# EAGLE design Display (EAGLE 4.14)
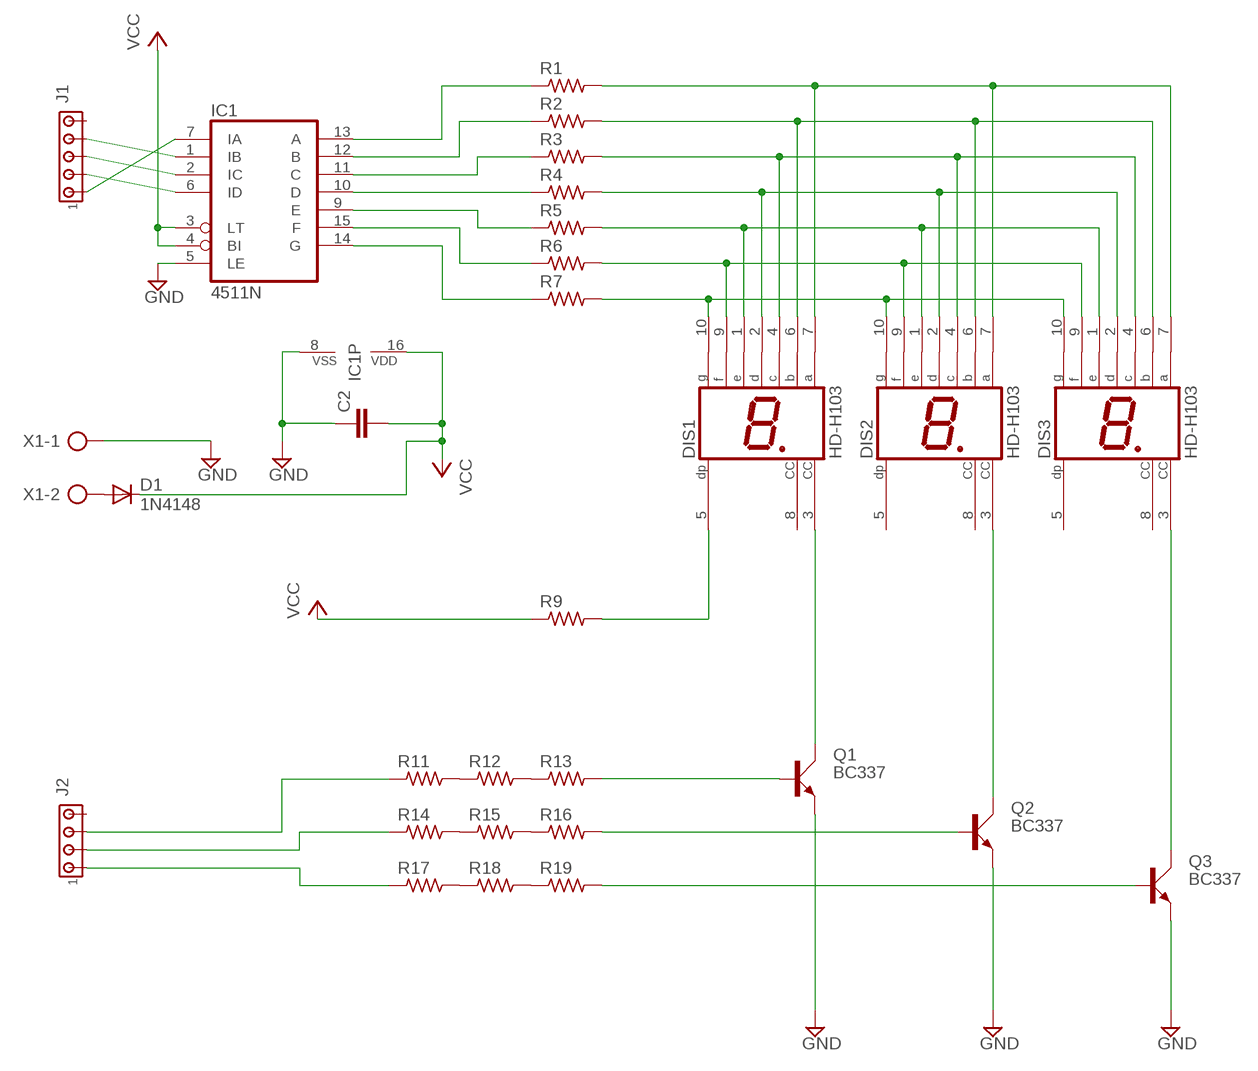
[diagram p0: schematic, sheet 1]

## Parts
C2  C5/3  [C5B3]
D1  1N4148  [DO35-10]
DIS1  HD-H103  [HDSP-M]
DIS2  HD-H103  [HDSP-M]
DIS3  HD-H103  [HDSP-M]
IC1  4511N  [DIL16]
J1  MTA05-100  [10X05MTA]
J2  MTA04-100  [10X04MTA]
Q1  BC337  [SOT54A]
Q2  BC337  [SOT54A]
Q3  BC337  [SOT54A]
R1  R_0603  [R0603]
R2  R_0603  [R0603]
R3  R_0603  [R0603]
R4  R_0603  [R0603]
R5  R_0603  [R0603]
R6  R_0603  [R0603]
R7  R_0603  [R0603]
R9  R_0603  [R0603]
R11  R_0603  [R0603]
R12  R_0603  [R0603]
R13  R_0603  [R0603]
R14  R_0603  [R0603]
R15  R_0603  [R0603]
R16  R_0603  [R0603]
R17  R_0603  [R0603]
R18  R_0603  [R0603]
R19  R_0603  [R0603]
X1  AK500/2  [AK500/2]

## Nets
GND: C2.1 IC1.5(LE) IC1.8(VSS) Q1.E Q2.E Q3.E X1.1
N$1: DIS1.10(G) DIS2.10(G) DIS3.10(G) R7.2
N$2: DIS1.9(F) DIS2.9(F) DIS3.9(F) R6.2
N$3: DIS1.1(E) DIS2.1(E) DIS3.1(E) R5.2
N$4: DIS1.2(D) DIS2.2(D) DIS3.2(D) R4.2
N$5: DIS1.4(C) DIS2.4(C) DIS3.4(C) R3.2
N$6: DIS1.6(B) DIS2.6(B) DIS3.6(B) R2.2
N$7: DIS1.7(A) DIS2.7(A) DIS3.7(A) R1.2
N$8: IC1.13(A) R1.1
N$9: IC1.14(G) R7.1
N$10: IC1.15(F) R6.1
N$11: IC1.12(B) R2.1
N$12: IC1.11(C) R3.1
N$13: IC1.9(E) R5.1
N$14: IC1.10(D) R4.1
N$16: DIS1.5(DP) R9.2
N$18: R11.2 R12.1
N$19: DIS1.3(CC) Q1.C
N$20: DIS2.3(CC) Q2.C
N$21: DIS3.3(CC) Q3.C
N$22: R12.2 R13.1
N$23: Q1.B R13.2
N$24: Q2.B R16.2
N$25: Q3.B R19.2
N$26: R14.2 R15.1
N$27: R15.2 R16.1
N$31: J2.3 R11.1
N$32: J2.2 R14.1
N$33: R17.2 R18.1
N$34: J2.1 R17.1
N$35: IC1.1(IB) J1.4
N$36: IC1.2(IC) J1.3
N$37: IC1.6(ID) J1.2
N$38: IC1.7(IA) J1.1
N$39: D1.A X1.2
N$40: R18.2 R19.1
VCC: C2.2 D1.C IC1.3(LT) IC1.4(BI) IC1.16(VDD) R9.1
Unconnected: DIS1.8(CC) DIS2.5(DP) DIS2.8(CC) DIS3.5(DP) DIS3.8(CC) J1.5 J2.4

## Library data of the parts
C2 = capacitor-wima:C: CAPACITOR naming: grid - package width
D1 = diode:1N4148: DIODE high speed (Philips)
DIS1-DIS3 = display-hp:HD-H103: LED DISPLAY 1-character 7 segment, decimal point right
IC1 = 45xx:4511: BCD to 7-segment LATCH/DECODER/DRIVER
J1 = con-amp:MTA05-100: AMP connector
J2 = con-amp:MTA04-100: AMP connector
Q1-Q3 = transistor-small-signal:BC337: NPN TRANSISTOR
R1-R7 R9 R11-R19 = rc-master:R_: RESISTOR
X1 = con-ptr500:AK500/2: CONNECTOR

## Board
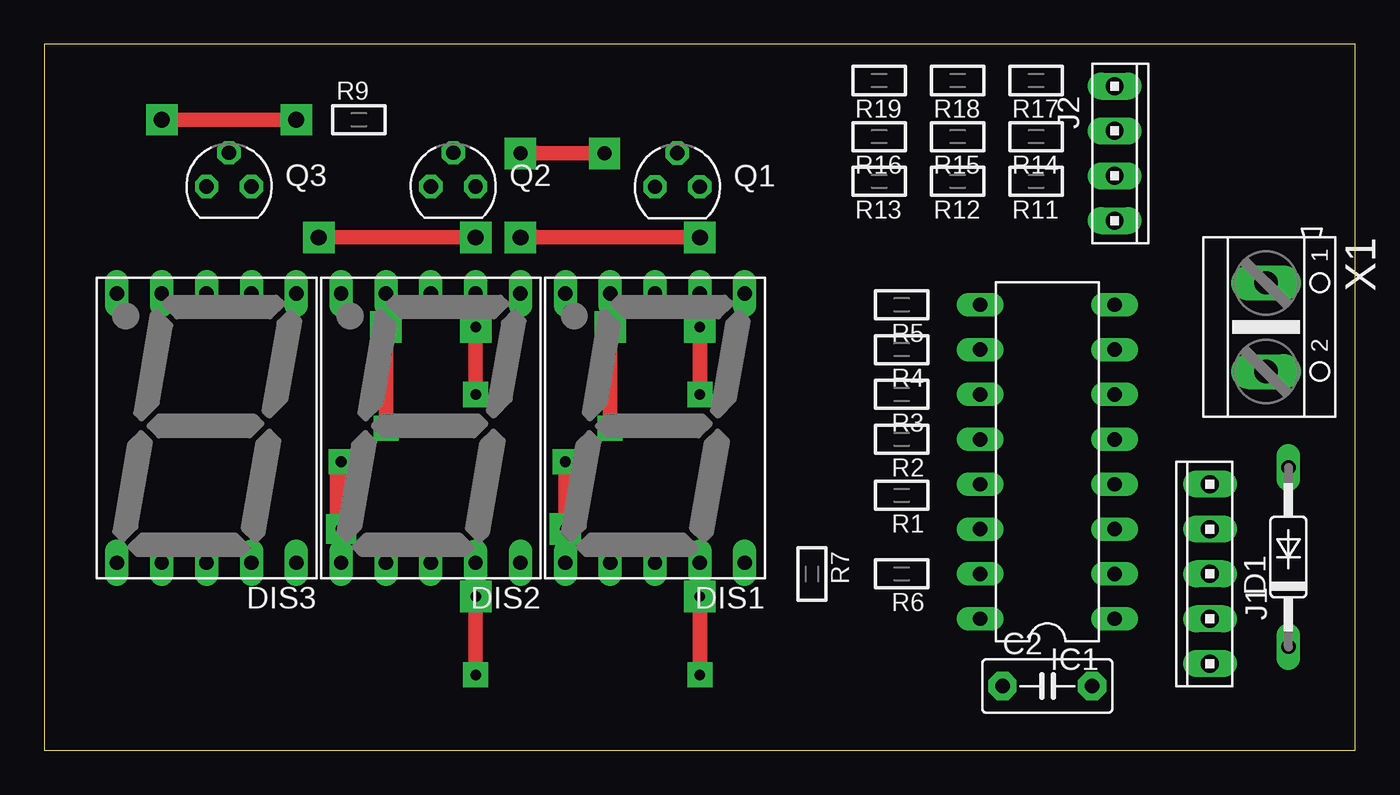
[diagram p1: board, top side]
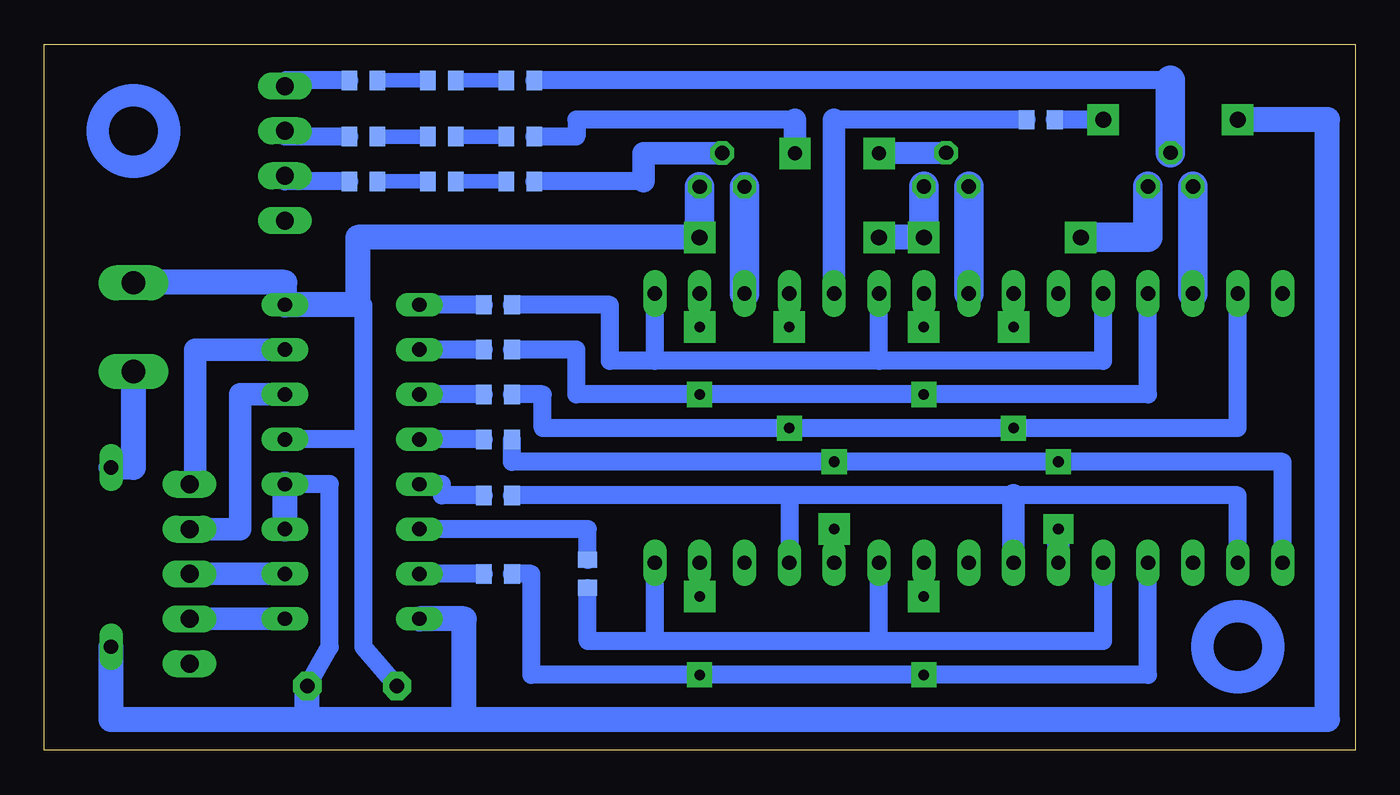
[diagram p2: board, bottom side, seen from below]

Size 74.28 x 39.99 mm. Coordinates in mm from the lower left corner, seen from the top.
Outline: 0,0 74.27,0 74.27,39.99 0,39.99 0,0
Copper layers (1*16): Top 0.035mm / dielectric 1.5mm / Bottom 0.035mm
Design rules "default": minimum track width 10mil, minimum drill 24mil, track to track 8mil, track to pad 8mil, pad to pad 8mil, via to via 8mil, smd to smd 8mil, copper to edge 40mil, drill to drill 8mil, minimum pad ring 10mil, minimum via ring 8mil, stop-mask expansion 4mil, vias tented up to drill 0mil, thermal gap 10mil

### Footprints (pad centres in the part's own frame; a part is rotated, then mirrored left to right if it is on the bottom)
C5B3 = drill 0.813 pad 1.6 octagon: 1 -2.54,0; 2 2.54,0
DO35-10 = drill 0.813 long: A 5.08,0; C -5.08,0
HDSP-M = drill 0.813 long: 1 -5.08,-7.62; 2 -2.54,-7.62; 3 0,-7.62; 4 2.54,-7.62; 5 5.08,-7.62; 6 5.08,7.62; 7 2.54,7.62; 8 0,7.62; 9 -2.54,7.62; 10 -5.08,7.62
DIL16 = drill 0.813 long: 1 -8.89,-3.81; 2 -6.35,-3.81; 3 -3.81,-3.81; 4 -1.27,-3.81; 5 1.27,-3.81; 6 3.81,-3.81; 7 6.35,-3.81; 8 8.89,-3.81; 9 8.89,3.81; 10 6.35,3.81; 11 3.81,3.81; 12 1.27,3.81; 13 -1.27,3.81; 14 -3.81,3.81; 15 -6.35,3.81; 16 -8.89,3.81
10X05MTA = drill 1.016 long: 1 5.08,0; 2 2.54,0; 3 0,0; 4 -2.54,0; 5 -5.08,0
10X04MTA = drill 1.016 long: 1 -3.81,0; 2 -1.27,0; 3 1.27,0; 4 3.81,0
SOT54A = drill 0.813 octagon: B 0,1.905; C -1.27,0; E 1.27,0
R0603 = smd 0.9 x 1.1 bottom: 1 -0.794,0; 2 0.794,0
AK500/2 = drill 1.321 long: 1 -2.515,0; 2 2.515,0

### Placement (x,y rotation side)
C2  56.83,3.65 0 top
D1  70.48,10.95 90 top
DIS1  34.6,18.25 180 top
DIS2  21.9,18.25 180 top
DIS3  9.2,18.25 180 top
IC1  56.83,16.35 90 top
J1  66.04,10 90 top
J2  60.64,33.81 270 top
Q1  35.87,31.92 0 top
Q2  23.17,31.94 0 top
Q3  10.47,31.94 0 top
R1  48.57,14.44 180 top
R2  48.57,17.62 180 top
R3  48.57,20.16 180 top
R4  48.57,22.7 180 top
R5  48.57,25.23 180 top
R6  48.57,10 180 top
R7  43.49,10 270 top
R9  17.83,35.71 0 top
R11  56.19,32.22 180 top
R12  51.75,32.22 180 top
R13  47.3,32.22 180 top
R14  56.19,34.76 180 top
R15  51.75,34.76 180 top
R16  47.3,34.76 180 top
R17  56.19,37.93 180 top
R18  51.75,37.93 180 top
R19  47.3,37.93 180 top
X1  69.21,23.96 270 top

### Tracks (layer width: path | path; a pad name or v marks a point on that pad's centre or on a via)
GND  (via drill 0.9 pad 1.78)
  Top 0.813: v15.55,29.04 v24.44,29.04 | v26.98,29.04 v37.14,29.04
  Bottom 1.016: 56.19,17.62 56.19,25.23 56.51,25.23 | 56.19,17.62 IC1.5 | 56.19,17.62 56.19,5.87 C2.1
  Bottom 1.422: v24.44,29.04 v26.98,29.04 | v37.14,29.04 56.51,29.04 56.51,25.23 IC1.8 60.64,26.5 69.21,26.5 X1.1 68.57,26.5
  Bottom 1.676: v24.44,29.04 Q2.E | v37.14,29.04 Q1.E | v15.55,29.04 11.74,29.04 Q3.E
N$1
  Bottom 0.813: DIS2.10 26.98,8.09
  Bottom 1.016: 26.98,6.18 14.28,6.18 DIS3.10 | 26.98,6.18 39.68,6.18 | 39.68,6.18 DIS1.10 | 26.98,6.18 DIS2.10 | 39.68,6.18 43.49,6.18 R7.2
N$2  (via drill 0.6 pad 1.42, 0.6 pad 1.78)
  Top 0.813: v37.14,8.73 v37.14,4.28 DIS1.9 | v24.44,4.28 v24.44,8.73
  Bottom 0.813: v24.44,8.73 DIS2.9 | v37.14,8.73 DIS1.9 v37.14,8.73
  Bottom 1.016: R6.2 46.67,10 46.67,4.28 v37.14,4.28 v24.44,4.28 11.74,4.28 DIS3.9
N$3
  Bottom 1.016: 26.98,22.06 14.28,22.06 DIS3.1 | 26.98,22.06 39.68,22.06 | 39.68,22.06 DIS1.1 | 26.98,22.06 DIS2.1 | 39.68,22.06 42.22,22.06 42.22,25.23 R5.2
N$4  (via drill 0.6 pad 1.42, 0.6 pad 1.78)
  Top 0.813: v37.14,20.16 v37.14,23.96 | v24.44,20.16 v24.44,23.96
  Bottom 0.813: v37.14,23.96 DIS1.2 | v24.44,23.96 DIS2.2
  Bottom 1.016: R4.2 44.13,22.7 44.13,20.16 v37.14,20.16 v24.44,20.16 11.74,20.16 DIS3.2
N$5  (via drill 0.6 pad 1.42, 0.6 pad 1.78)
  Top 0.813: v19.36,18.25 v19.36,23.96 | v32.06,18.25 v32.06,23.96
  Bottom 0.813: v19.36,23.96 DIS2.4 | v32.06,23.96 DIS1.4
  Bottom 1.016: R3.2 46.03,20.16 46.03,18.25 v32.06,18.25 v19.36,18.25 6.66,18.25 DIS3.4
N$6  (via drill 0.6 pad 1.42, 0.6 pad 1.68, 0.6 pad 1.78)
  Top 0.813: v29.52,16.35 v29.52,12.54
  Top 1.27: v16.82,16.35 v16.82,12.54
  Bottom 0.813: v29.52,12.54 DIS1.6
  Bottom 1.016: R2.2 47.78,16.35 v29.52,16.35 v16.82,16.35 4.12,16.35 DIS3.6
  Bottom 1.27: v16.82,12.54 DIS2.6
N$7
  Bottom 1.016: 32.06,14.44 19.36,14.44 6.66,14.44 DIS3.7 | 32.06,14.44 R1.2 | 32.06,14.44 DIS1.7
  Bottom 1.27: 19.36,14.44 DIS2.7
N$8
  Bottom 1.016: R1.1 51.75,14.44 51.75,15.07 IC1.13
N$9
  Bottom 1.016: R7.1 43.49,12.54 IC1.14
N$10
  Bottom 1.016: R6.1 IC1.15
N$11
  Bottom 1.016: R2.1 IC1.12
N$12
  Bottom 1.016: R3.1 IC1.11
N$13
  Bottom 1.016: R5.1 IC1.9
N$14
  Bottom 1.016: R4.1 IC1.10
N$16
  Bottom 1.016: R9.2 29.52,35.71
  Bottom 1.27: 29.52,35.71 DIS1.5
N$18
  Bottom 0.813: R12.1 R11.2
N$19
  Bottom 1.676: DIS1.3 Q1.C
N$20
  Bottom 1.676: DIS2.3 Q2.C
N$21
  Bottom 1.676: DIS3.3 Q3.C
N$22
  Bottom 0.813: R13.1 R12.2
N$23
  Bottom 1.016: 40.32,32.22 R13.2
  Bottom 1.27: 40.32,32.22 40.32,33.82 Q1.B
N$24  (via drill 0.8 pad 1.78)
  Top 0.813: v26.98,33.81 v31.74,33.81
  Bottom 1.016: 31.74,35.71 44.13,35.71 44.13,34.76 R16.2
  Bottom 1.27: Q2.B v26.98,33.81 | v31.74,33.81 31.74,35.71
N$25
  Bottom 1.016: 10.47,37.93 R19.2
  Bottom 1.676: Q3.B 10.47,37.93
N$26
  Bottom 0.813: R15.1 R14.2
N$27
  Bottom 0.813: R16.1 R15.2
N$31
  Bottom 1.016: R11.1 60.64,32.22 J2.3
N$32
  Bottom 1.016: R14.1 60.64,34.76 J2.2
N$33
  Bottom 0.813: R18.1 R17.2
N$34
  Bottom 1.016: R17.1 60.64,37.93 J2.1
N$35
  Bottom 1.27: IC1.1 J1.4
N$36
  Bottom 1.27: IC1.2 J1.3
N$37
  Bottom 1.27: IC1.6 63.18,20.16 63.18,12.54 J1.2
N$38
  Bottom 1.27: J1.1 65.72,15.07 65.72,22.7 IC1.7
N$39
  Bottom 1.422: D1.A 69.21,16.03 X1.2
N$40
  Bottom 0.813: R19.1 R18.2
VCC  (via drill 0.9 pad 1.78)
  Top 0.813: v6.66,35.71 v14.28,35.71
  Bottom 1.016: v14.28,35.71 R9.1 | IC1.4 58.1,15.07 58.1,5.87 C2.2
  Bottom 1.422: v6.66,35.71 1.58,35.71 1.58,1.74 50.48,1.74 | 50.48,1.74 59.37,1.74 | 59.37,1.74 C2.2 | IC1.16 50.48,7.46 50.48,1.74 | IC1.4 IC1.3 | D1.C 70.48,1.74 59.37,1.74
(copper drawn outside any net)
  shapes: Bottom circle x2